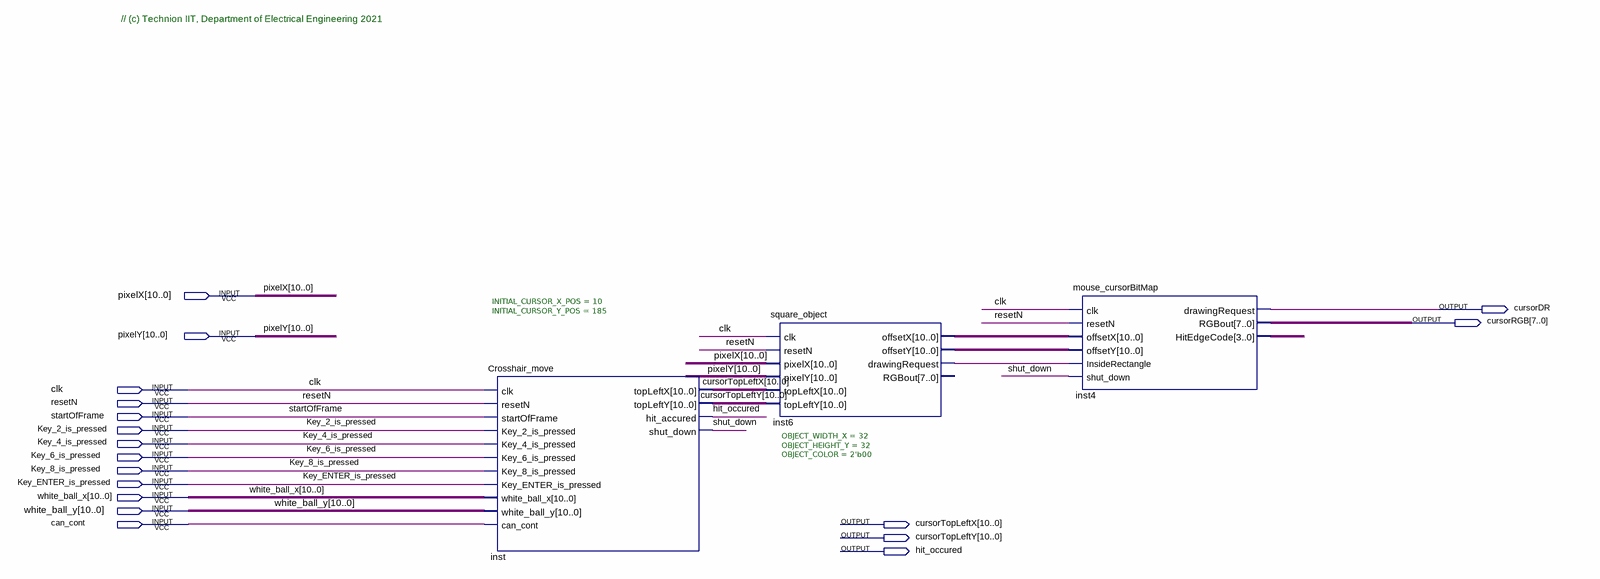
[diagram p0: schematic sheet]
// Quartus schematic Crosshair_block.bdf as structural Verilog: 3 symbols, 18 pins
module Crosshair_block (
  input  [10:0] pixelX,
  input  [10:0] pixelY,
  input  clk,
  input  resetN,
  input  startOfFrame,
  input  Key_2_is_pressed,
  input  Key_4_is_pressed,
  input  Key_6_is_pressed,
  input  Key_8_is_pressed,
  input  Key_ENTER_is_pressed,
  input  [10:0] white_ball_x,
  input  [10:0] white_ball_y,
  input  can_cont,
  output cursorDR,
  output [7:0] cursorRGB,
  output [10:0] cursorTopLeftX,
  output [10:0] cursorTopLeftY,
  output hit_occured
);

  wire inst6_drawingrequest, shut_down;
  wire [3:0] inst4_hitedgecode;
  wire [10:0] inst6_offsetx, inst6_offsety;

  Crosshair_move #(.INITIAL_CURSOR_X_POS(10), .INITIAL_CURSOR_Y_POS(185)) inst (
    .clk(clk), .resetN(resetN), .startOfFrame(startOfFrame), .Key_2_is_pressed(Key_2_is_pressed),
    .Key_4_is_pressed(Key_4_is_pressed), .Key_6_is_pressed(Key_6_is_pressed),
    .Key_8_is_pressed(Key_8_is_pressed), .Key_ENTER_is_pressed(Key_ENTER_is_pressed),
    .white_ball_x(white_ball_x), .white_ball_y(white_ball_y), .can_cont(can_cont), .topLeftX(cursorTopLeftX),
    .topLeftY(cursorTopLeftY), .hit_accured(hit_occured), .shut_down(shut_down));
  square_object #(.OBJECT_WIDTH_X(32), .OBJECT_HEIGHT_Y(32), .OBJECT_COLOR(2'b00)) inst6 (
    .clk(clk), .resetN(resetN), .pixelX(pixelX), .pixelY(pixelY), .topLeftX(cursorTopLeftX),
    .topLeftY(cursorTopLeftY), .offsetX(inst6_offsetx), .offsetY(inst6_offsety),
    .drawingRequest(inst6_drawingrequest));  // open: RGBout
  mouse_cursorBitMap inst4 (
    .clk(clk), .resetN(resetN), .offsetX(inst6_offsetx), .offsetY(inst6_offsety),
    .InsideRectangle(inst6_drawingrequest), .shut_down(shut_down), .drawingRequest(cursorDR),
    .RGBout(cursorRGB), .HitEdgeCode(inst4_hitedgecode));

  // Notes on the sheet:
  //   // (c) Technion IIT, Department of Electrical Engineering 2021
endmodule
